# EAGLE schematic Enclosure 63x58 PB (EAGLE 9.6.2)
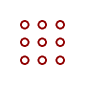
[diagram p0: schematic, sheet 1]

## Parts
U$1  PROTO-20X18  [PROTO-20X18]

## Library data of the parts
U$1 = digitalconcepts:PROTO-20X18: 20 x 18 Prototyping board to fit a 63 x 58 enclosure